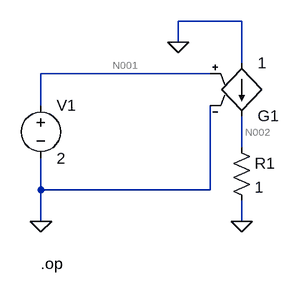
[diagram p0: schematic g_example.asc]
g_example.asc, the LTspice schematic file:
Version 4
SHEET 1 880 680
WIRE 384 0 288 0
WIRE 288 32 288 0
WIRE 384 64 384 0
WIRE 336 80 80 80
WIRE 80 128 80 80
WIRE 384 192 384 144
WIRE 80 256 80 208
WIRE 336 256 336 128
WIRE 336 256 80 256
WIRE 80 304 80 256
WIRE 384 304 384 272
FLAG 80 304 0
FLAG 384 304 0
FLAG 288 32 0
SYMBOL g2 384 160 M180
SYMATTR InstName G1
SYMATTR Value 1
SYMBOL voltage 80 112 R0
WINDOW 123 0 0 Left 0
WINDOW 39 0 0 Left 0
SYMATTR InstName V1
SYMATTR Value 2
SYMBOL res 368 176 R0
SYMATTR InstName R1
SYMATTR Value 1
TEXT 80 368 Left 0 !.op

The netlist it stands for:
* g_example.asc
G1 0 N002 N001 0 1
V1 N001 0 2
R1 N002 0 1
.op
.backanno
.end

* Results of the author's LTspice run, read from the files saved beside the schematic
* Operating Point:
*   V(n002) = 2 V
*   V(n001) = 2 V
*   I(R1) = 2 A
*   I(G1) = 2 A
*   I(V1) = 0 A